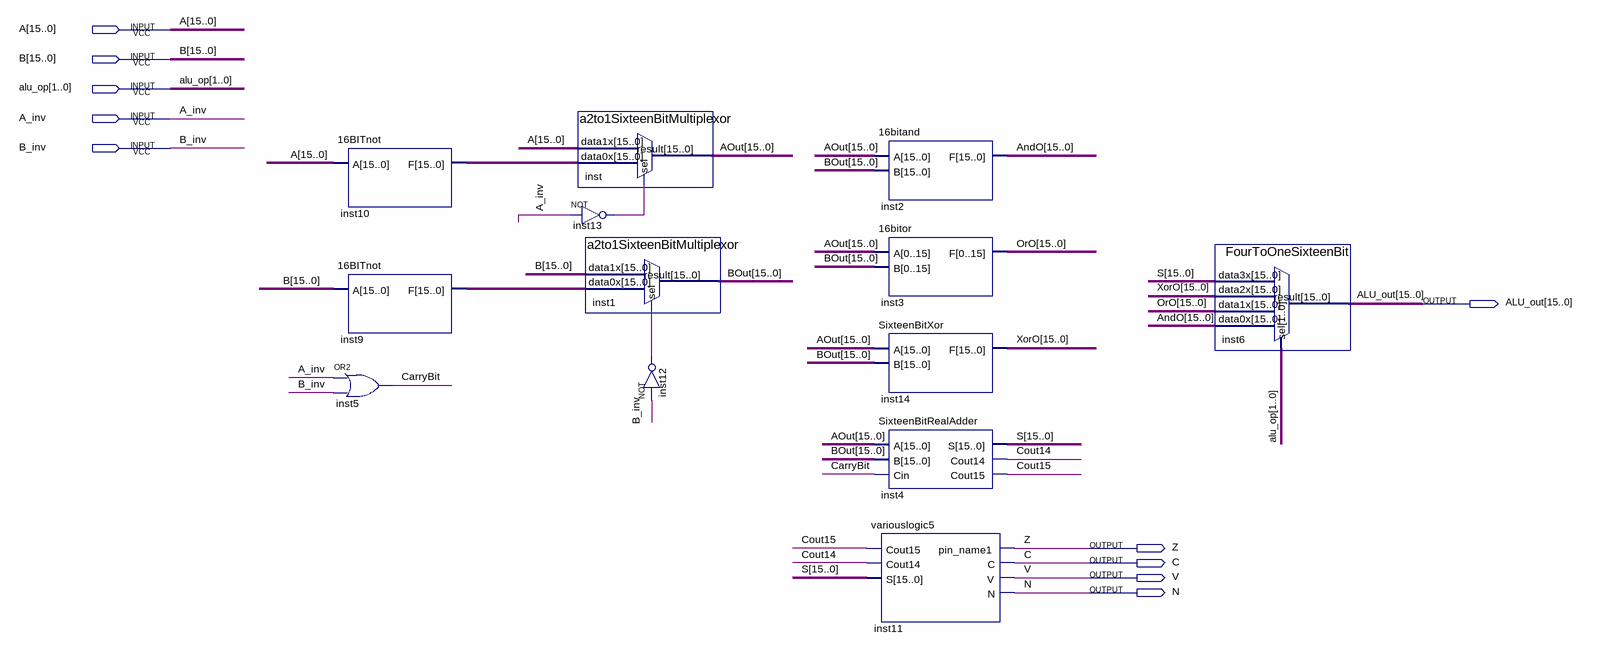
[diagram p0: schematic sheet]
// Quartus schematic ALU.bdf as structural Verilog: 13 symbols, 10 pins
module ALU (
  input  [15:0] A,
  input  [15:0] B,
  input  [1:0] alu_op,
  input  A_inv,
  input  B_inv,
  output [15:0] ALU_out,
  output Z,
  output C,
  output V,
  output N
);

  wire CarryBit, Cout14, Cout15, inst12_out, inst13_out;
  wire [15:0] AndO, AOut, BOut, inst9_f, inst10_f, OrO, S, XorO;

  \16BITnot  inst10 (.A(A), .F(inst10_f));
  \16BITnot  inst9 (.A(B), .F(inst9_f));
  or inst5 (CarryBit, A_inv, B_inv);
  a2to1SixteenBitMultiplexor inst (.data1x(A), .data0x(inst10_f), .sel(inst13_out), .result(AOut));
  not inst13 (inst13_out, A_inv);
  a2to1SixteenBitMultiplexor inst1 (.data1x(B), .data0x(inst9_f), .sel(inst12_out), .result(BOut));
  not inst12 (inst12_out, B_inv);
  \16bitand  inst2 (.A(AOut), .B(BOut), .F(AndO));
  \16bitor  inst3 (.A(AOut), .B(BOut), .F(OrO));
  SixteenBitXor inst14 (.A(AOut), .B(BOut), .F(XorO));
  SixteenBitRealAdder inst4 (.A(AOut), .B(BOut), .Cin(CarryBit), .S(S), .Cout14(Cout14), .Cout15(Cout15));
  variouslogic5 inst11 (.Cout15(Cout15), .Cout14(Cout14), .S(S), .pin_name1(Z), .C(C), .V(V), .N(N));
  FourToOneSixteenBit inst6 (.data3x(S), .data2x(XorO), .data1x(OrO), .data0x(AndO), .sel(alu_op), .result(ALU_out));
endmodule
